# Altium schematic sheet Main.SchDoc
size A4
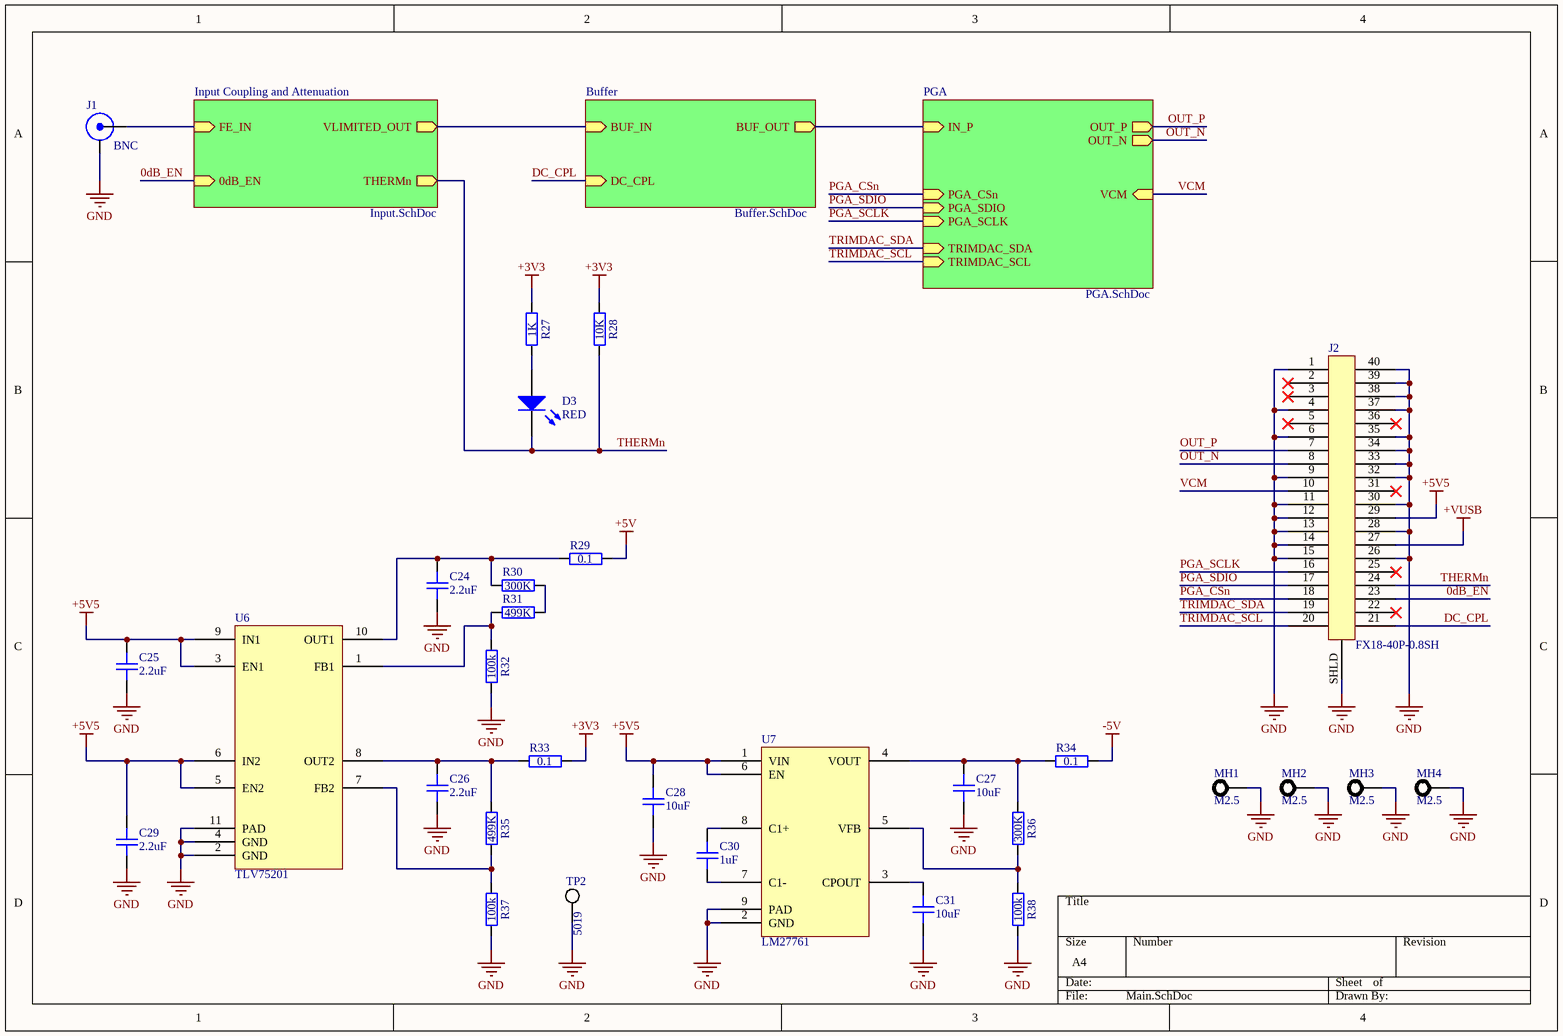
[diagram p0: Main.SchDoc]

## Parts
C24  value 2.2uF  [GEN_C_0402]  (hidden comment: CAP 2.2uF 10V X5R 0402)
C25  value 2.2uF  [GEN_C_0402]  (hidden comment: CAP 2.2uF 10V X5R 0402)
C26  value 2.2uF  [GEN_C_0402]  (hidden comment: CAP 2.2uF 10V X5R 0402)
C27  value 10uF  [GEN_C_0603]  (hidden comment: CAP 10uF 10V X5R 0603)
C28  value 10uF  [GEN_C_0603]  (hidden comment: CAP 10uF 10V X5R 0603)
C29  value 2.2uF  [GEN_C_0402]  (hidden comment: CAP 2.2uF 10V X5R 0402)
C30  value 1uF  [GEN_C_0402]  (hidden comment: CAP 1uF 25V X5R 0402)
C31  value 10uF  [GEN_C_0603]  (hidden comment: CAP 10uF 10V X5R 0603)
D3  RED  [LED_0603_APT1608]
J1  BNC  [MOL_0731000105]
J2  FX18-40P-0.8SH  [HIR_FX18-40P-0.8SH]
MH1  M2.5  [MH M2.5]  (no BOM)
MH2  M2.5  [MH M2.5]  (no BOM)
MH3  M2.5  [MH M2.5]  (no BOM)
MH4  M2.5  [MH M2.5]  (no BOM)
R27  value 1K  [GEN_R_0402]  (hidden comment: RES 1K OHM 1% 1/10W 0402)
R28  value 10K  [GEN_R_0402]  (hidden comment: RES 10K OHM 1% 1/10W 0402)
R29  0.1  [GEN_R_0402]
R30  value 300K  [GEN_R_0402]  (hidden comment: RES 300K OHM 1% 1/10W 0402)
R31  value 499K  [GEN_R_0402]  (hidden comment: RES 499K OHM 1% 1/10W 0402)
R32  value 100k  [GEN_R_0402]  (hidden comment: RES 100K OHM 1% 1/10W 0402)
R33  0.1  [GEN_R_0402]
R34  0.1  [GEN_R_0402]
R35  value 499K  [GEN_R_0402]  (hidden comment: RES 499K OHM 1% 1/10W 0402)
R36  value 300K  [GEN_R_0402]  (hidden comment: RES 300K OHM 1% 1/10W 0402)
R37  value 100k  [GEN_R_0402]  (hidden comment: RES 100K OHM 1% 1/10W 0402)
R38  value 100k  [GEN_R_0402]  (hidden comment: RES 100K OHM 1% 1/10W 0402)
TP2  5019  [KEY_5019]
U6  TLV75201  [TI_WSON10_DSQ0010A]
U7  LM27761  [TI_WSON8_DSG0008A]

## Sub-sheets
Buffer = Buffer.SchDoc: BUF_IN (in), BUF_OUT (out), DC_CPL (in)
Input Coupling and Attenuation = Input.SchDoc: 0dB_EN (in), FE_IN (in), VLIMITED_OUT (out), THERMn (out)
PGA = PGA.SchDoc: IN_P (in), OUT_N (out), PGA_SDIO (in), OUT_P (out), VCM (in), PGA_SCLK (in), PGA_CSn (in), TRIMDAC_SDA (in), TRIMDAC_SCL (in)

## Nets
+3V3: R27.1 R28.2 R33.2
+5V: R29.2
+5V5: C25.2 C28.2 C29.2 J2.29 U6.3(EN1) U6.5(EN2) U6.6(IN2) U6.9(IN1) U7.1(VIN) U7.6(EN)
+VUSB: J2.27
-5V: R34.2
GND: C24.1 C25.1 C26.1 C27.1 C28.1 C29.1 C31.1 J1.2(SHIELD) J2.1 J2.4 J2.6 J2.9 J2.11 J2.12 J2.13 J2.14 J2.15 J2.26 J2.28 J2.30 J2.32 J2.33 J2.34 J2.35 J2.37 J2.38 J2.39 J2.40 J2.SHLD MH1.1 MH2.1 MH3.1 MH4.1 R32.1 R37.1 R38.1 TP2.1 U6.2(GND) U6.4(GND) U6.11(PAD) U7.2(GND) U7.9(PAD)
0dB_EN: J2.23 ; sheet Input Coupling and Attenuation/0dB_EN
DC_CPL: J2.21 ; sheet Buffer/DC_CPL
OUT_N: J2.8 ; sheet PGA/OUT_N
OUT_P: J2.7 ; sheet PGA/OUT_P
PGA_CSn: J2.18 ; sheet PGA/PGA_CSn
PGA_SCLK: J2.16 ; sheet PGA/PGA_SCLK
PGA_SDIO: J2.17 ; sheet PGA/PGA_SDIO
THERMn: D3.1(K) J2.24 R28.1 ; sheet Input Coupling and Attenuation/THERMn
TRIMDAC_SCL: J2.20 ; sheet PGA/TRIMDAC_SCL
TRIMDAC_SDA: J2.19 ; sheet PGA/TRIMDAC_SDA
VCM: J2.10 ; sheet PGA/VCM
NetC24_2: C24.2 R29.1 R30.2 U6.10(OUT1)
NetC26_2: C26.2 R33.1 R35.2 U6.8(OUT2)
NetC27_2: C27.2 R34.1 R36.2 U7.4(VOUT)
NetC30_1: C30.1 U7.7(C1-)
NetC30_2: C30.2 U7.8(C1+)
NetC31_2: C31.2 U7.3(CPOUT)
NetD3_2: D3.2(A) R27.2
NetJ1_1: J1.1(Signal) ; sheet Input Coupling and Attenuation/FE_IN
NetR30_1: R30.1 R31.1
NetR31_2: R31.2 R32.2 U6.1(FB1)
NetR35_1: R35.1 R37.2 U6.7(FB2)
NetR36_1: R36.1 R38.2 U7.5(VFB)
(unnamed): sheet Input Coupling and Attenuation/VLIMITED_OUT, sheet Buffer/BUF_IN
(unnamed): sheet Buffer/BUF_OUT, sheet PGA/IN_P

Not connected (* = marked no-connect by the designer): J2 2* 3* 5* 22* 25* 31* 36*

## Library data of the parts
D3 = LED RED 0603 APT1608: Supplier 1: Digi-Key; Supplier Part Number 1: 754-1930-1-ND
J1 = BNC JACK R/A: Supplier 1: Digi-Key; Supplier Part Number 1: WM5524-ND
J2 = CONN HDR FX18-40P-0.8SH: Supplier 1: Digi-Key; Supplier Part Number 1: H11868-ND
MH1-MH4 = MH M2.5
R27 = RES 1K OHM 1% 1/10W 0402: Power Rating: 0.1W; Tolerance: 1%; Package: 0402; Supplier 1: Digi-Key; Supplier Part Number 1: P1.00KLCT-ND
R28 = RES 10K OHM 1% 1/10W 0402: Power Rating: 0.1W; Tolerance: 1%; Package: 0402; Supplier 1: Digi-Key; Supplier Part Number 1: P10.0KLCT-ND
R29 R33 R34 = RES 0.1 OHM 1% 1/6W 0402: Tolerance: 1%; Power Rating: 0.16W; Package: 0402; Supplier 1: Digi-Key; Supplier Part Number 1: P.10AKCT-ND; Value: 0.1
R30 R36 = RES 300K OHM 1% 1/10W 0402: Power Rating: 0.1W; Tolerance: 1%; Package: 0402; Supplier 1: Digi-Key; Supplier Part Number 1: P300KLCT-ND
R31 R35 = RES 499K OHM 1% 1/10W 0402: Power Rating: 0.1W; Tolerance: 1%; Package: 0402; Supplier 1: Digi-Key; Supplier Part Number 1: P499KLCT-ND
R32 R37 R38 = RES 100K OHM 1% 1/10W 0402: Power Rating: 0.1W; Tolerance: 1%; Package: 0402; Supplier 1: Digi-Key; Supplier Part Number 1: P100KLCT-ND
TP2 = TP KEYSTONE 5019: Supplier 1: Digi-Key; Supplier Part Number 1: 36-5019CT-ND
U6 = IC LDO TLV75201: Supplier 1: Digi-Key; Supplier Part Number 1: 296-TLV75201PDSQRCT-ND
U7 = IC CPUMP LM27761: Supplier 1: Digi-Key; Supplier Part Number 1: 296-44379-1-ND
C24-C26 C29 = CAP 2.2uF 10V X5R 0402: Package: 0402; Voltage Rating: 10V; Supplier 1: Digi-Key; Supplier Part Number 1: 587-3153-1-ND
C27 C28 C31 = CAP 10uF 10V X5R 0603: Package: 0402; Voltage Rating: 10V; Supplier 1: Digi-Key; Supplier Part Number 1: 490-10474-1-ND
C30 = CAP 1uF 25V X5R 0402: Package: 0402; Voltage Rating: 25V; Supplier 1: Digi-Key; Supplier Part Number 1: 490-10017-1-ND